# EAGLE schematic Load Bank Mosfet Control Board rev2 (EAGLE 8.4.1)
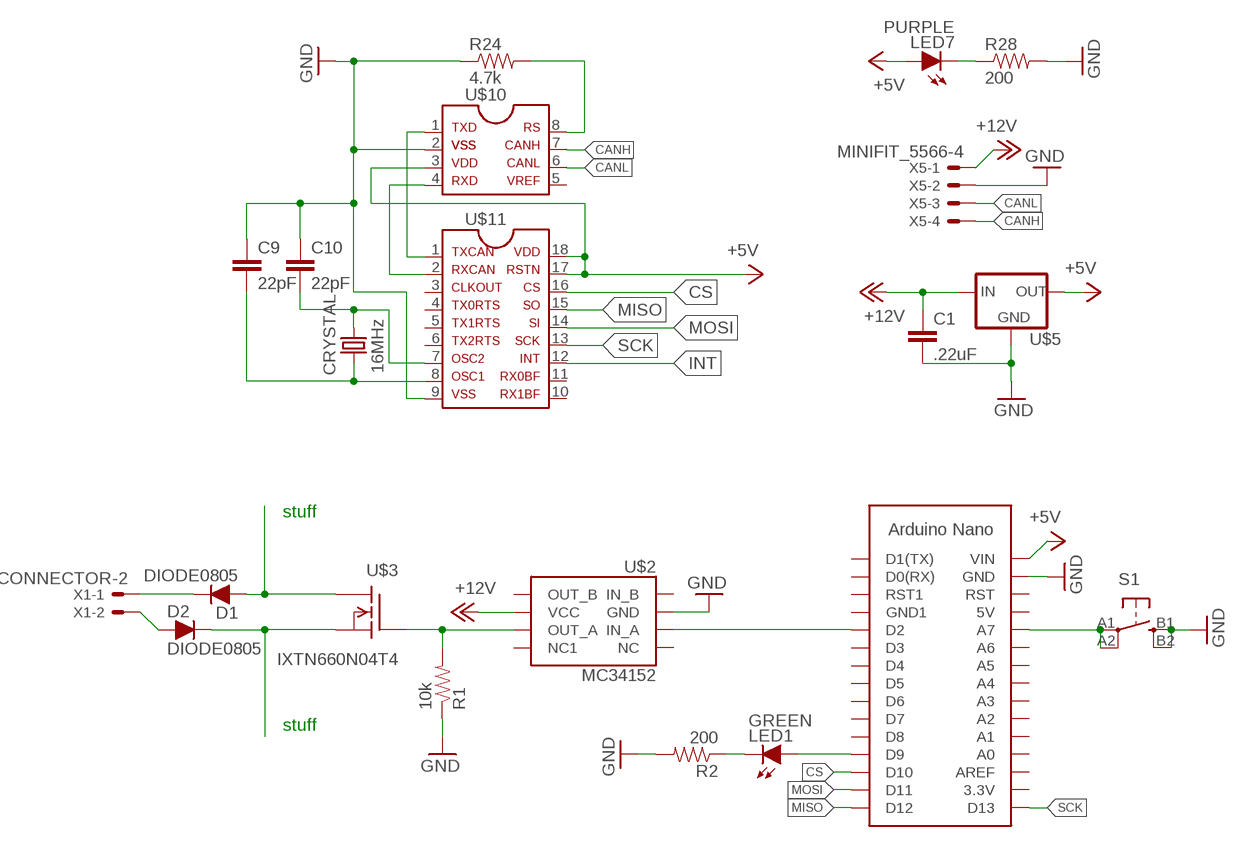
[diagram p0: schematic, sheet 1]

## Parts
C1  .22uF  CAP0805  [0805]
C9  22pF  CAP0805  [0805]
C10  22pF  CAP0805  [0805]
CRYSTAL  16MHz  CRYSTALSMD  [HC49UP]
D1  DIODE0805  [0805_D]
D2  DIODE0805  [0805_D]
LED1  GREEN  LED-0805  [LED-805]
LED7  PURPLE  LED-0805  [LED-805]
R1  10k  RESISTOR0805-RES  [0805]
R2  200  RESISTOR0805-RES  [0805]
R24  4.7k  RESISTOR0805-RES  [0805]
R28  200  RESISTOR0805-RES  [0805]
S1  BTN_10-XXSMD  [TACTILE_SWITCH_SMD_6.2MM_TALL]
U$2  MC34152  [SOIC-08]
U$3  IXTN660N04T4  [SOT-227B]
U$4  ARDUINO_NANO  [ARDUINO_NANO]
U$5  5VREG_LM340-NLM340MPX-5.0/NOPB  [SOT223]
U$10  MCP2551  [SOIC-08]
U$11  MCP2515SMD  [SOIC-18W]
X1  CONNECTOR-2  [MINIFIT_5566-2]
X5  MINIFIT_5566-4  [MINIFIT_5566-4]

## Nets
+5V: LED7.A U$4.VIN U$5.3(OUT) U$10.3 U$11.17 U$11.18
+12V: C1.1 U$2.6(VCC) U$5.1(IN) X5.1
CANH: U$10.7 X5.4
CANL: U$10.6 X5.3
CS: U$4.D10 U$11.16
GND: C1.2 C9.1 C10.1 R1.1 R2.2 R24.1 R28.2 S1.B1(S) S1.B2(S1) U$2.3(GND) U$4.GND U$5.2(GND) U$5.4(GND) U$10.2 U$11.9 X5.2
INT: U$11.12
MISO: U$4.D12 U$11.15
MOSI: U$4.D11 U$11.14
N$1: D1.C X1.1
N$2: D1.A U$3.P$1(D)
N$3: R1.2 U$2.7(OUT_A) U$3.P$4(G)
N$4: U$2.2(IN_A) U$4.D2
N$5: D2.C U$3.P$2(S) U$3.P$3(S)
N$6: LED1.A U$4.D9
N$7: D2.A X1.2
N$8: LED1.C R2.1
N$9: S1.A1(P) S1.A2(P1) U$4.A7
N$37: U$10.1 U$11.1
N$39: U$10.4 U$11.2
N$40: C9.2 CRYSTAL.2 U$11.8
N$41: R24.2 U$10.8
N$42: C10.2 CRYSTAL.1 U$11.7
N$61: LED7.C R28.1
SCK: U$4.D13 U$11.13
Unconnected: U$2.1(NC) U$2.4(IN_B) U$2.5(OUT_B) U$2.8(NC1) U$4.3.3V U$4.5V U$4.A0 U$4.A1 U$4.A2 U$4.A3 U$4.A4 U$4.A5 U$4.A6 U$4.AREF U$4.D0(RX) U$4.D1(TX) U$4.D3 U$4.D4 U$4.D5 U$4.D6 U$4.D7 U$4.D8 U$4.GND1 U$4.RST U$4.RST1 U$10.5 U$11.3 U$11.4 U$11.5 U$11.6 U$11.10 U$11.11

## Notes on the sheet
- stuff
- stuff

## Library data of the parts
C1 C9 C10 = HyTechDevices:CAP: Capacitor Standard 0603 ceramic capacitor, and 0.1" leaded capacitor.
CRYSTAL = SparkFun-FreqCtrl:CRYSTAL: Various standard crystals. Proven footprints.
D1 D2 = HyTechDevices:DIODE: DIODE general purpose rectifier
LED1 LED7 = HyTechDevices:LED: Light Emitting Diode (LED) Source: Dangerous Prototypes Eagle Library <https://github.com/DangerousPrototypes/Eagle_Part_Library>
R1 R2 R24 R28 = HyTechDevices:RESISTOR: Resistor Basic schematic elements and footprints for 0603, 1206, and PTH resistors.
S1 = HyTechDevices:BTN_10-XX: Small momentary tactile push button
U$2 = HyTechDevices:MC34152: Microchip MC34152 High Speed Dual MOSFET Driver
U$3 = HyTechDevices:IXTN660N04T4: IXTN660N04T4 N-Channel Power MOSFET
U$4 = HyTechDevices:ARDUINO_NANO: Arduino Nano Device Specifications <https://www.arduino.cc/en/Main/ArduinoBoardNano> Pinout Diagram <http://pighixxx.com/nanopdf.pdf>
U$5 = HyTechDevices:5VREG_LM340-N: Voltage Regulator 5v linear voltage regulator Datasheet <http://www.mouser.com/ProductDetail/Texas-Instruments/LM340MPX-50-NOPB/?qs=X1J7HmVL2ZGZwtTFRQ9ItA%3D%3D> MAX current out: 1.5A MAX voltage in: 35V
U$10 = HyTechDevices:MCP2551: MCP2551 High-Speed CAN Transceiver Product Webpage <https://www.microchip.com/wwwproducts/en/MCP2551> Datasheet <http://ww1.microchip.com/downloads/en/DeviceDoc/21667f.pdf> This device is outdated It is replaced by MCP2561. Comparison Page <https://www.microchip.com/wwwproducts/ProductCompare/MCP2551/MCP2561> Product Webpage <https://www.microchip.com/wwwproducts/en/MCP2561> Datasheet <http://ww1.microchip.com/downloads/en/DeviceDoc/20005167C.pdf>
U$11 = HyTechDevices:MCP2515: MCP2515 CAN Controller with SPI Interface Datasheet <http://ww1.microchip.com/downloads/en/DeviceDoc/21801G.pdf>
X1 = HyTechDevices:CONNECTOR-2: Mini-Fit Junior connector 2 pole Source: http://www.molex.com; OC_FARNELL: 1822072; OC_NEWARK: unknown
X5 = HyTechDevices:MINIFIT_5566-4: Mini-Fit Junior connector 4 pole Source: http://www.molex.com; OC_FARNELL: unknown; OC_NEWARK: unknown